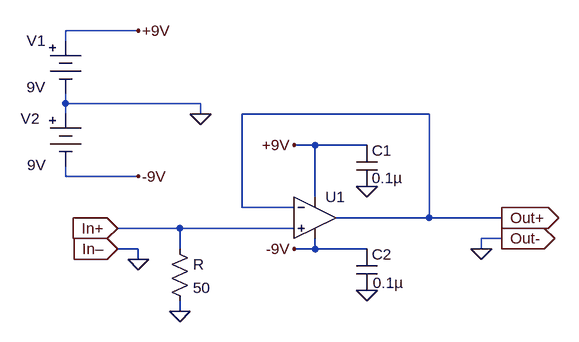
[diagram p0: schematic lab_circuit.asc]
lab_circuit.asc, the LTspice schematic file:
Version 4
SHEET 1 884 680
WIRE 224 -32 112 -32
WIRE 112 -16 112 -32
WIRE 112 80 112 64
WIRE 320 80 112 80
WIRE 112 96 112 80
WIRE 320 96 320 80
WIRE 672 96 384 96
WIRE 496 144 464 144
WIRE 576 144 496 144
WIRE 112 192 112 176
WIRE 224 192 112 192
WIRE 496 224 496 144
WIRE 384 240 384 96
WIRE 464 240 384 240
WIRE 672 256 672 96
WIRE 672 256 528 256
WIRE 784 256 672 256
WIRE 288 272 192 272
WIRE 464 272 288 272
WIRE 784 288 752 288
WIRE 224 304 192 304
WIRE 288 304 288 272
WIRE 496 304 496 288
WIRE 496 304 464 304
WIRE 576 304 496 304
WIRE 752 304 752 288
WIRE 224 320 224 304
WIRE 288 400 288 384
FLAG 464 144 +9V
FLAG 576 208 0
FLAG 576 368 0
FLAG 464 304 -9V
FLAG 288 400 0
FLAG 752 304 0
FLAG 784 256 Out+
IOPIN 784 256 Out
FLAG 784 288 Out-
IOPIN 784 288 Out
FLAG 224 320 0
FLAG 192 272 In+
IOPIN 192 272 In
FLAG 192 304 In–
IOPIN 192 304 In
FLAG 320 96 0
FLAG 224 -32 +9V
FLAG 224 192 -9V
SYMBOL Opamps/UniversalOpamp2 496 256 R0
SYMATTR InstName U1
SYMBOL cap 560 144 R0
WINDOW 3 24 51 Left 2
SYMATTR InstName C1
SYMATTR Value 0.1µ
SYMBOL cap 560 304 R0
WINDOW 3 25 52 Left 2
SYMATTR InstName C2
SYMATTR Value 0.1µ
SYMBOL res 272 288 R0
SYMATTR InstName R
SYMATTR Value 50
SYMBOL Misc/battery 112 -32 R0
WINDOW 0 -60 15 Left 2
WINDOW 3 -60 87 Left 2
SYMATTR InstName V1
SYMATTR Value 9V
SYMBOL Misc/battery 112 80 R0
WINDOW 0 -69 23 Left 2
WINDOW 3 -59 95 Left 2
SYMATTR InstName V2
SYMATTR Value 9V

The netlist it stands for:
* lab_circuit.asc
XU1 In+ Out+ +9V -9V Out+ level.2 Avol=1Meg GBW=10Meg Slew=10Meg ilimit=25m rail=0 Vos=0 phimargin=45 en=0 enk=0 in=0 ink=0 Rin=500Meg  ; pins IN+ IN- V+ V- OUT
C1 +9V 0 0.1µ
C2 -9V 0 0.1µ
R In+ 0 50
V1 +9V 0 9V
V2 0 -9V 9V
.lib UniversalOpamps2.sub
.backanno
.end